# EAGLE design 20A Motor Controller with SLAVE OUT (EAGLE 8.2.1)
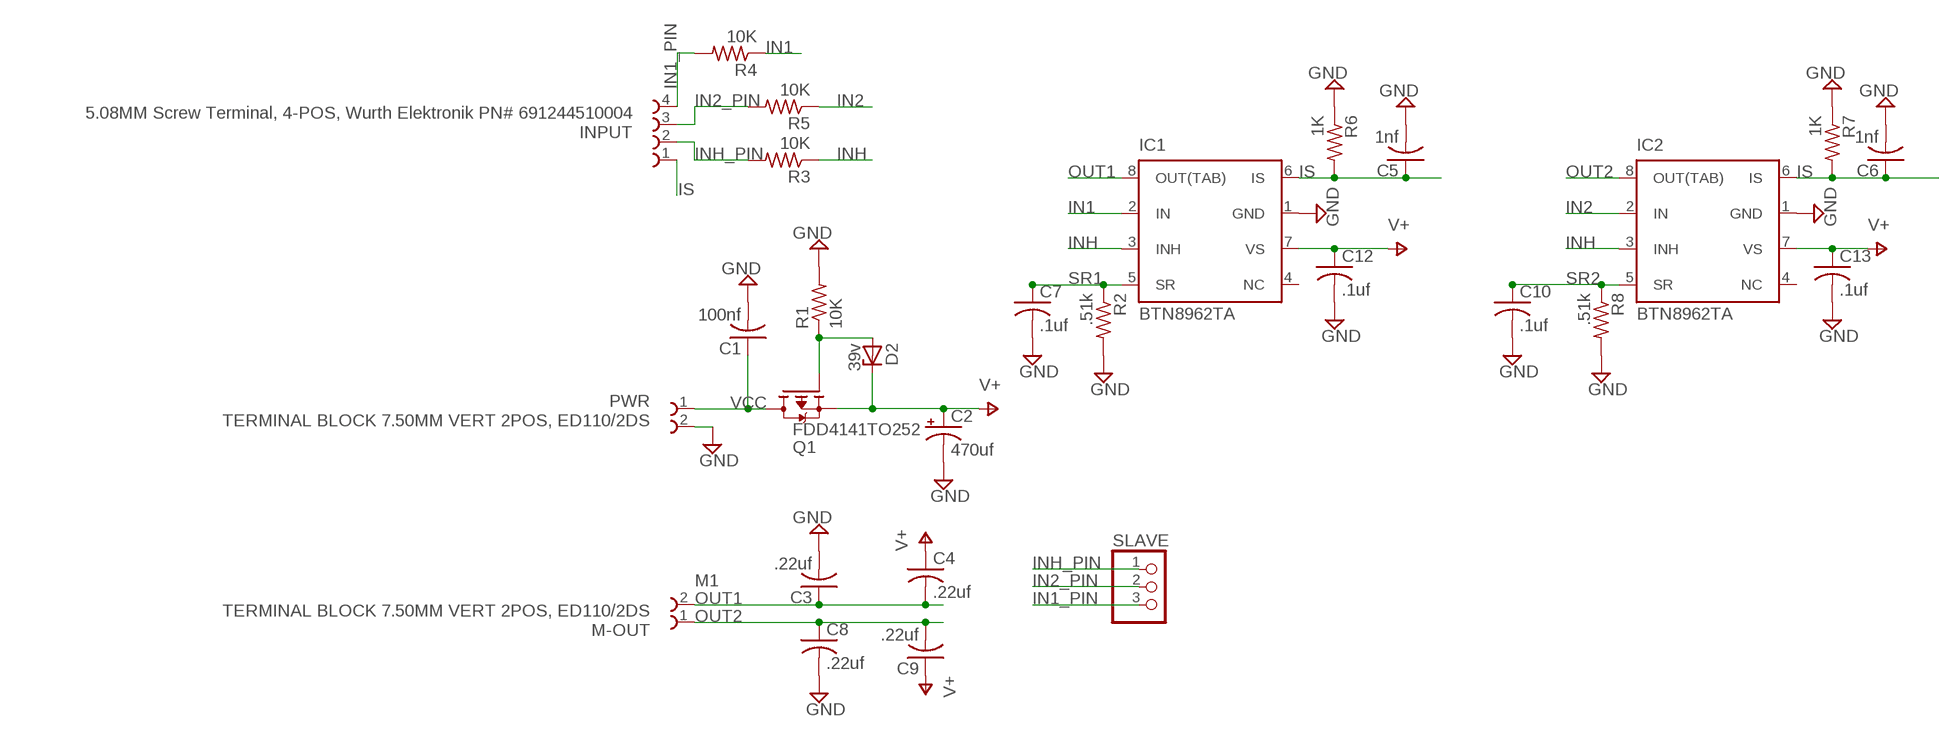
[diagram p0: schematic, sheet 1]

## Parts
C1  100nf  C-USC0805  [C0805]
C2  470uf  CPOL-USTT5D10  [TT5D10]
C3  .22uf  C-USC0805  [C0805]
C4  .22uf  C-USC0805  [C0805]
C5  1nf  C-USC0805  [C0805]
C6  1nf  C-USC0805  [C0805]
C7  .1uf  C-USC0805  [C0805]
C8  .22uf  C-USC0805  [C0805]
C9  .22uf  C-USC0805  [C0805]
C10  .1uf  C-USC0805  [C0805]
C12  .1uf  C-USC0805  [C0805]
C13  .1uf  C-USC0805  [C0805]
D2  39v  ZENER-DIODESMB  [SMB]
IC1  BTN8962TA  [P-TO263-7-1_LG_PADS]
IC2  BTN8962TA  [P-TO263-7-1_LG_PADS]
INPUT  5.08MM Screw Terminal, 4-POS, Wurth Elektronik PN# 691244510004  691244510004  [691244510004]
M-OUT  TERMINAL BLOCK 7.50MM VERT 2POS, ED110/2DS  7-5MM-SCREW-TERM  [7-5MM-SCREW-TERM]
PWR  TERMINAL BLOCK 7.50MM VERT 2POS, ED110/2DS  7-5MM-SCREW-TERM  [7-5MM-SCREW-TERM]
Q1  FDD4141TO252  [TO252]
R1  10K  R-US_R0805  [R0805]
R2  .51k  R-US_R0805  [R0805]
R3  10K  R-US_R0805  [R0805]
R4  10K  R-US_R0805  [R0805]
R5  10K  R-US_R0805  [R0805]
R6  1K  R-US_R0805  [R0805]
R7  1K  R-US_R0805  [R0805]
R8  .51k  R-US_R0805  [R0805]
SLAVE  PINHD-1X3CB  [1X03-CLEANBIG]

## Nets
GND: C1.2 C2.- C3.2 C5.2 C6.2 C7.2 C8.2 C10.2 C12.2 C13.2 IC1.1(GND) IC2.1(GND) PWR.2 R1.2 R2.2 R6.1 R7.1 R8.2
IN1: IC1.2(IN) R4.1
IN1_PIN: INPUT.4 R4.2 SLAVE.3
IN2: IC2.2(IN) R5.1
IN2_PIN: INPUT.3 R5.2 SLAVE.2
INH: IC1.3(INH) IC2.3(INH) R3.1
INH_PIN: INPUT.2 R3.2 SLAVE.1
IS: C5.1 C6.1 IC1.6(IS) IC2.6(IS) INPUT.1 R6.2 R7.2
OUT1 [PWR]: C3.1 C4.2 IC1.8(OUT(TAB)) M-OUT.2
OUT2 [PWR]: C8.1 C9.2 IC2.8(OUT(TAB)) M-OUT.1
Q1_GATE: D2.A Q1.1(G) R1.1
SR1: C7.1 IC1.5(SR) R2.1
SR2: C10.1 IC2.5(SR) R8.1
V+: C2.+ C4.1 C9.1 C12.1 C13.1 D2.C IC1.7(VS) IC2.7(VS) Q1.2(S)
VCC: C1.1 PWR.1 Q1.3(D)
Unconnected: IC1.4(NC) IC2.4(NC)

## Notes on the sheet
- M1

## Library data of the parts
C1 C3-C10 C12 C13 = adafruit:C-US: CAPACITOR, American symbol
C2 = adafruit:CPOL-US: POLARIZED CAPACITOR, American symbol
D2 = diode:ZENER-DIODE: Z-Diode
IC1 IC2 = my-custom-lib:BTN8962TA: 30A Half-H-Bridge for DC-Motor Applications TO-263-7 package Digkey: https://www.digikey.com/product-detail/en/BTN8962TAAUMA1/BTN8962TAAUMA1INCT-ND/4772020 Mouser: http://www.mouser.com/Search/ProductDetail.aspx?R=BTN8962TAAUMA1virtualkey63830000virtualkey726-BTN8962TAAUMA1
INPUT = Wurth_Elektronik_Electromechanic_Terminal_Blocks_Connectors_rev16e:691244510004: SERIE 2445 - 5.08 MM - HORIZONTAL CABLE ENTRY WITH RISING CAGE CLAMP - WR-TBL =>ConTBL2 691244510004 Characteristics INSULATOR:PA6/66 FLAMABILITY RATING: UL94V0 COLOR: GREEN METAL HOUSING: COPPER ALLOY / Ni+Sn TERMINAL SCREW: STEEL / Zn WIRE GUARD: COPPER ALLOY / Ni+Sn OPERATING TEMPERATURE:-30°C UP TO +120°C COMPLIANCE: LEAD FREE AND ROHS ELECTRICAL UL VDE CURRENT RATING: 16A 24A WORKING VOLTAGE: 300VAC 450VAC WITHSTANDING VOLTAGE: 1,6KV 2,5KV <http://katalog.we-online.de/media/images/v2/Family_TBL_5_08_2445_HORIZONTAL_CABLE_ENTRY_W_RISING_CAGE_6912445100xx.jpg> Details see: http://katalog.we-online.de/en/em/TBL_5_08_2445_HORIZONTAL_CABLE_ENTRY_W_RISING_CAGE_6912445100xx 2015 (C) Wurth Elektronik
M-OUT PWR = my-custom-lib:7-5MM-SCREW-TERM: On Shore Technology Inc. ED110/2DS 2-Position, 7.5mm Pitch(0.295"), 14/22AWG, 300V/20A https://www.digikey.com/product-detail/en/on-shore-technology-inc/ED110-2DS/ED1605-ND/33880
Q1 = transistor-fet:FDD4141: P-Channel PowerTrench® MOSFET Source: FDD4141.pdf
R1-R8 = rcl:R-US_: RESISTOR, American symbol
SLAVE = adafruit:PINHD-1X3: PIN HEADER

## Net classes
0 default: width 0.152 mm, drill 0.305 mm, clearance 0.152 mm
1 GND: width 0.152 mm, drill 0.305 mm, clearance 0.152 mm
2 PWR: width 0.305 mm, drill 0.305 mm, clearance 0.203 mm

## Board
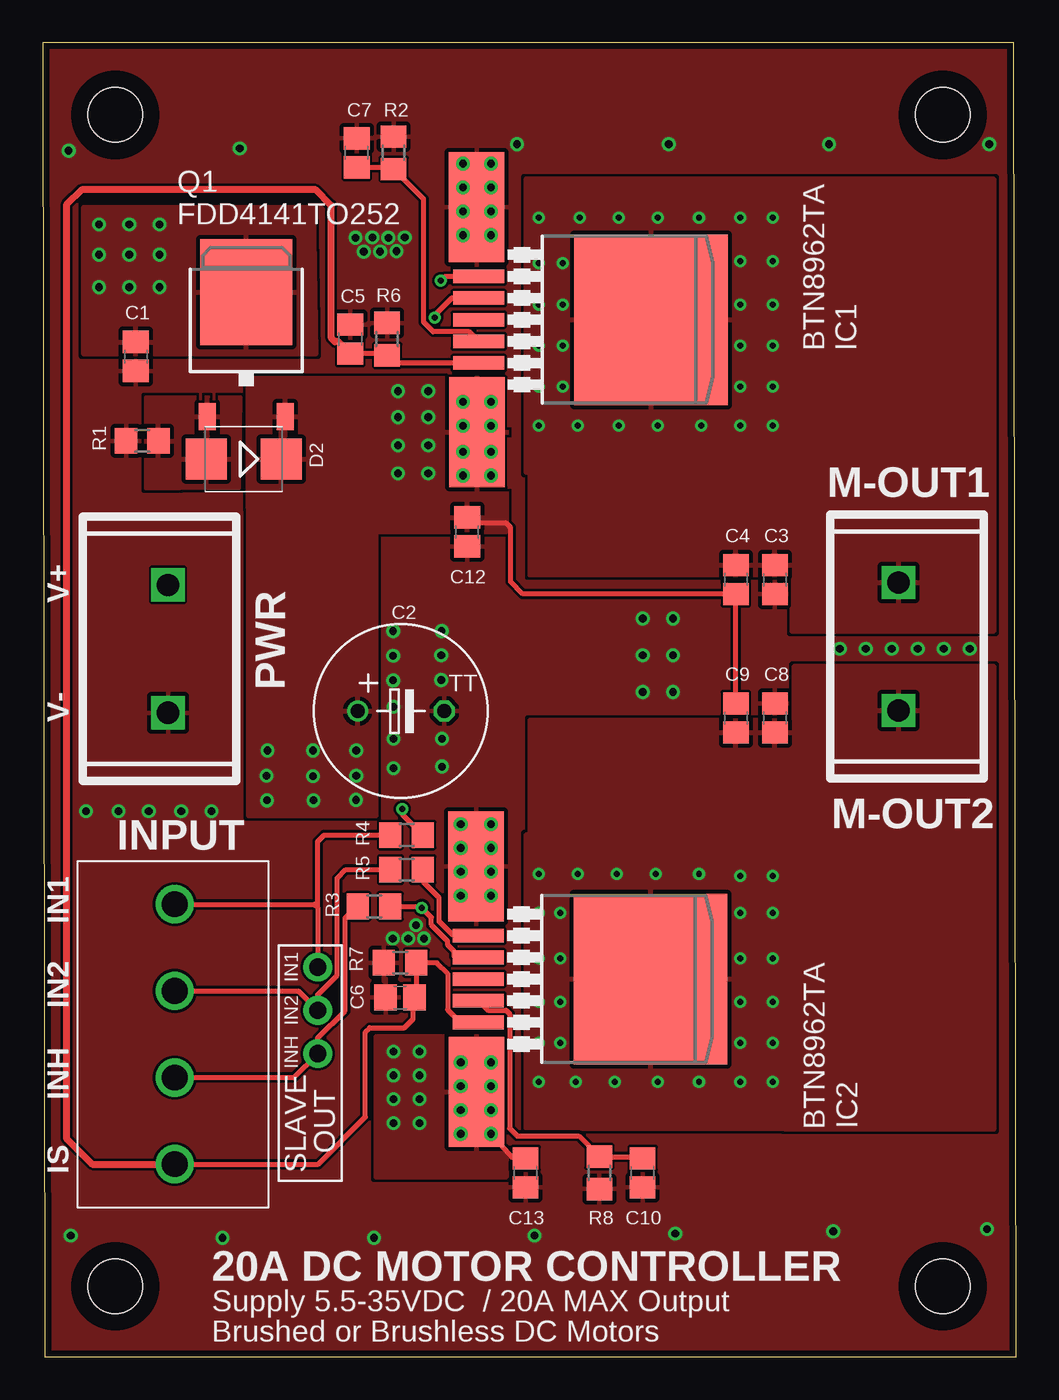
[diagram p1: board, top side]
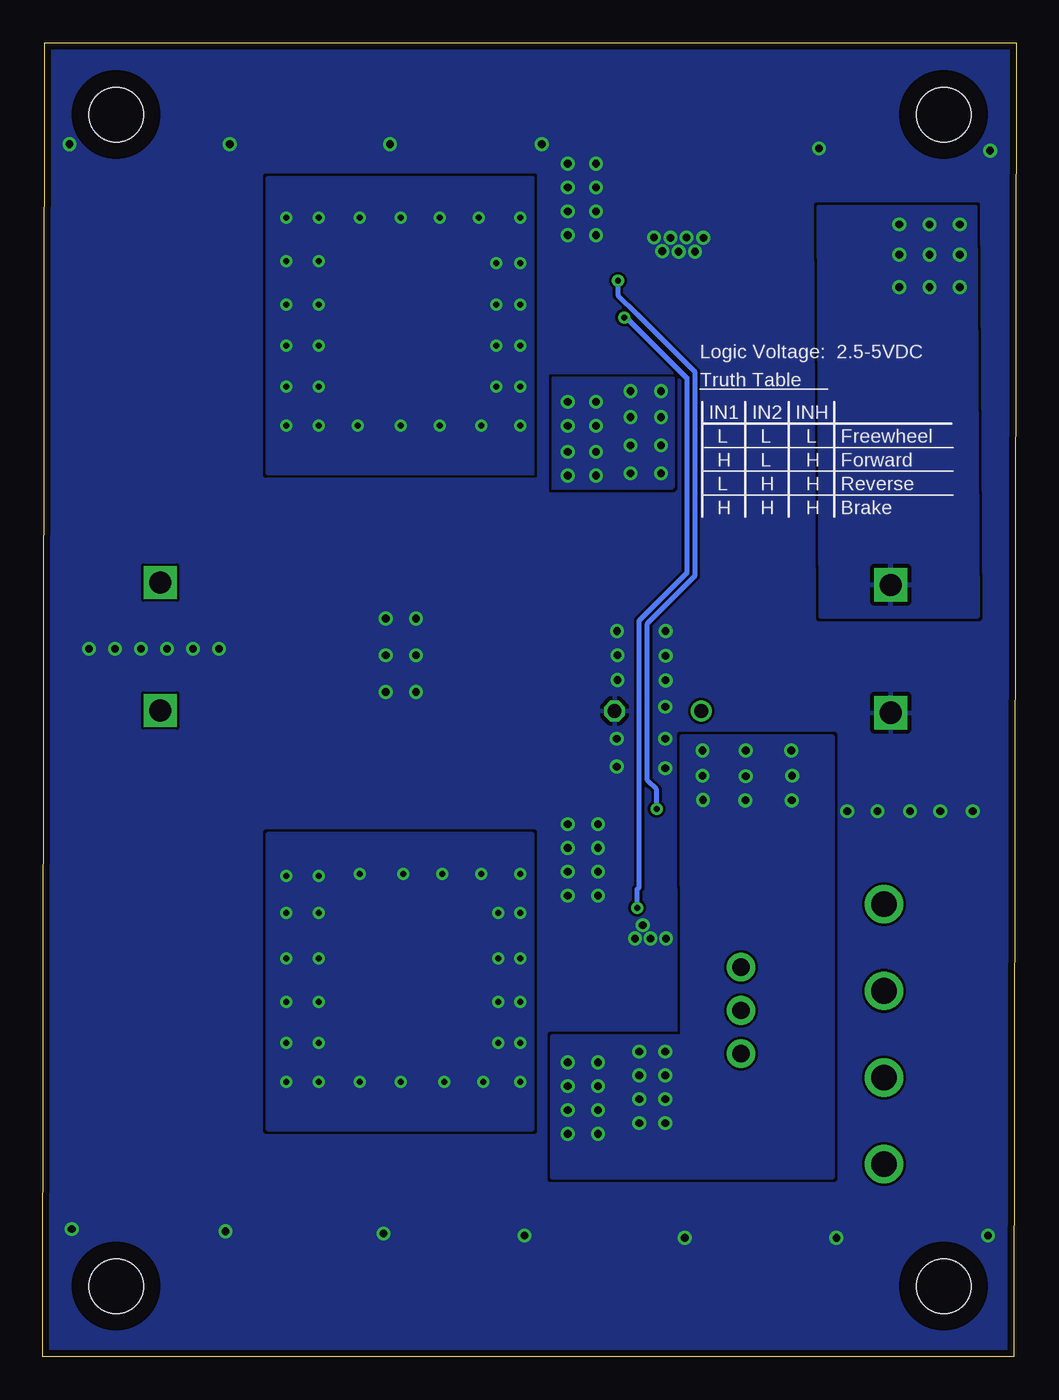
[diagram p2: board, bottom side, seen from below]

Size 57.07 x 77.08 mm. Coordinates in mm from the lower left corner, seen from the top.
Outline: 0.13,0 57.07,0 56.95,77.08 0,77.08 0.13,0
Copper layers (1*16): Top 0.0356mm / dielectric 1.5011mm / Bottom 0.0356mm
Design rules "oshpark-2layer": minimum track width 6mil, minimum drill 13mil, track to track 6mil, track to pad 6mil, pad to pad 6mil, via to via 6mil, smd to smd 6mil, copper to edge 15mil, drill to drill 6mil, minimum pad ring 7mil, minimum via ring 7mil, stop-mask expansion 2.5mil, vias tented up to drill 0mil, thermal gap 10mil
Holes 3.19 mm at 52.77,72.85 4.25,72.85 4.25,4.15 52.77,4.15
tKeepout: area 28.3,13.3 to 43.8,30.7; area 28.3,51.8 to 43.8,69.2
bKeepout: area 28.3,13.3 to 43.8,30.7; area 28.3,51.8 to 43.8,69.2
tRestrict: area 50.8,70.9 to 54.7,74.8; area 2.3,70.9 to 6.2,74.8; area 2.3,2.2 to 6.2,6.1; area 50.8,2.2 to 54.7,6.1
bRestrict: area 50.8,70.9 to 54.7,74.8; area 2.3,70.9 to 6.2,74.8; area 2.3,2.2 to 6.2,6.1; area 50.8,2.2 to 54.7,6.1

### Footprints (pad centres in the part's own frame; a part is rotated, then mirrored left to right if it is on the bottom)
C0805 = smd 1.3 x 1.5: 1 -0.85,0; 2 0.85,0
TT5D10 = drill 0.813: + -2.54,0 | drill 0.813 octagon: - 2.54,0
SMB = smd 2.4 x 2.4: A 2.2,0; C -2.2,0
P-TO263-7-1_LG_PADS = smd 6.452 x 3.251: 1 -6.604,-9.335; 7 6.604,-9.309 | smd 0.8 x 3: 2 -2.54,-9.207; 3 -1.27,-9.207; 4 0,-9.207; 5 1.27,-9.207; 6 2.54,-9.207 | smd 10 x 9: 8 0,0.895
691244510004 = drill 1.5: 1 -7.62,0; 2 -2.54,0; 3 2.54,0; 4 7.62,0
7-5MM-SCREW-TERM = drill 1.3 square: 1 -4,1; 2 3.5,1
TO252 = smd 1 x 1.6: 1 -2.28,-4.8; 2 2.28,-4.8 | smd 5.4 x 6.2: 3 0,2.5
R0805 = smd 1.3 x 1.5: 1 -0.95,0; 2 0.95,0
1X03-CLEANBIG = drill 1.016 pad 1.676: 1 -2.54,0; 2 0,0; 3 2.54,0

### Placement (x,y rotation side)
C1  5.46,58.67 270 top
C2  21.01,37.87 0 top
C3  42.93,45.59 270 top
C4  40.64,45.59 90 top
C5  18.03,59.69 90 top
C6  20.95,21.08 180 top
C7  18.42,70.61 90 top
C8  42.93,37.47 90 top
C9  40.64,37.47 270 top
C10  35.18,10.79 270 top
C12  24.89,48.39 270 top
C13  28.32,10.79 270 top
D2  11.79,52.65 180 top
IC1  34.78,60.83 270 top
IC2  34.75,22.16 270 top
INPUT  7.75,18.92 90 top
M-OUT  51.18,41.91 90 top
PWR  6.35,41.27 270 top
Q1  11.94,59.94 0 top
R1  5.84,53.72 180 top
R2  20.57,70.61 90 top
R3  19.43,26.42 180 top
R4  21.34,30.61 180 top
R5  21.34,28.58 180 top
R6  20.19,59.69 270 top
R7  20.95,23.11 0 top
R8  32.64,10.79 270 top
SLAVE  16.13,20.32 90 top

### Tracks (layer width: path | path; a pad name or v marks a point on that pad's centre or on a via)
GND  (via drill 0.45)
  other vias: 24.64,69.98 26.29,69.98 24.64,68.58 24.64,67.18 24.64,65.79 26.29,65.79 26.29,68.58 26.29,67.18 46.74,41.53 48.26,41.53 49.78,41.53 51.31,41.53 52.83,41.53 54.36,41.53 24.51,27.05 26.29,27.05 26.29,28.45 26.29,29.85 36.96,43.31 24.51,31.24 24.51,29.85 24.51,28.45 36.96,41.15 36.96,38.99 26.29,31.24 20.55,41.12 20.57,38.13 20.57,34.52 2.54,32 4.45,32 8.13,32 1.65,7.11 10.54,6.98 19.43,6.98 28.83,7.11 37.08,7.24 46.36,7.37 55.37,7.49 1.52,70.74 11.56,70.87 27.81,71.12 36.7,71.12 46.1,71.12 55.5,71.12 20.55,39.67 20.57,36.25 6.22,32 9.91,32 35.18,43.31 35.18,41.15 35.18,38.99 23.42,34.62 23.42,36.25 23.37,39.7 23.37,41.15 20.55,42.57 23.39,42.57 21.44,24.54 22.35,24.54 20.52,24.54 21.89,25.32 18.34,65.63 19.33,65.66 20.27,65.63 21.23,65.66 18.82,64.82 19.79,64.82 20.75,64.85
  pour Top (rank 6): 0,77.09 0.13,0 56.9,0 56.9,77.09
  pour Bottom (rank 6): 0,77.09 0.13,0 56.9,0 56.9,77.09
IN1  (via drill 0.35)
  Top 0.305: IC1.2 23.59,63.37 v23.34,63.12 | v21.08,32.13 21.08,31.82 R4.1
  Bottom 0.305: v23.34,63.12 23.34,62.28 22.23,61.16 18.85,57.79 18.85,45.79 21.62,43.02 21.62,33.81 21.08,33.27 v21.08,32.13
IN1_PIN
  Top 0.305: 16.13,26.35 SLAVE.3 | 16.13,26.35 16.13,30.23 16.51,30.61 R4.2 | 16.13,26.35 15.94,26.54 INPUT.4
IN2
  Top 0.305: IC2.2 24,24.77 23.24,25.53 23.24,26.92 22.35,27.81 R5.1
IN2_PIN
  Top 0.305: R5.2 17.78,28.58 17.27,28.07 17.27,22.39 16.13,21.24 SLAVE.2 14.99,21.46 INPUT.3
INH  (via drill 0.35)
  Top 0.305: IC2.3 25.48,23.5 24.13,23.5 24.13,23.78 23.74,24.17 23.74,24.38 23.67,24.45 23.05,25.07 22.78,25.34 22.78,25.78 v22.23,26.34 21.97,26.42 R3.1 | IC1.3 24,62.1 22.99,61.09 v22.99,60.96
  Bottom 0.305: v22.99,60.96 22.73,60.83 19.3,57.4 19.3,45.97 22.1,43.18 22.1,27.51 22.23,27.43 v22.23,26.34
INH_PIN
  Top 0.305: R3.2 18.16,26.16 17.73,25.73 17.73,20.3 16.13,18.7 SLAVE.1 14.73,16.38 INPUT.2
IS
  Top 0.305: IC1.6 20.65,58.29 R6.2 20.09,58.84 C5.1 | IC2.6 24.48,19.62 23.74,20.36 23.74,22.49 23.11,23.11 R7.2 21.91,21.18 C6.1 21.72,20.99 21.72,19.81 21.21,19.3 19.18,19.3 18.92,19.05 18.92,14.07 16.15,11.3 INPUT.1
  Top 0.406: C5.1 17.34,59.53 17.14,59.53 16.93,59.74 16.93,67.53 16,68.45 2.29,68.45 1.4,67.56 1.4,12.83 2.92,11.3 INPUT.1 | 25.48,19.69 IC2.6
OUT1  (via drill 0.35)
  other vias: 29.08,66.8 29.08,64.13 29.08,61.72 29.08,59.31 29.08,56.9 29.08,54.61 33.78,66.8 36.07,66.8 38.48,66.8 40.89,66.8 40.89,64.26 40.89,61.72 40.89,59.31 40.89,56.9 40.89,54.61 33.78,54.61 36.07,54.61 38.61,54.61 42.8,66.8 42.8,64.26 42.8,61.72 42.8,59.31 42.8,56.9 42.8,54.61 31.5,66.8 30.48,64.13 30.48,61.72 30.48,59.31 30.48,56.9 31.37,54.61
  pour Bottom: 43.87,69.11 43.87,51.86 28.36,51.86 28.36,69.11
  pour Top: 43.87,69.11 43.87,51.86 28.36,51.86 28.36,69.11
  pour Top: 55.75,42.55 43.94,42.55 43.94,45.72 44.07,45.85 28.58,45.85 28.58,52.07 43.56,52.07 43.56,69.09 55.75,69.09
OUT2  (via drill 0.35)
  other vias: 29.08,28.32 29.08,26.04 29.08,18.42 29.08,23.37 29.08,20.83 40.89,26.04 33.66,28.32 35.94,28.32 38.48,28.32 40.89,28.19 42.8,28.19 29.08,16.13 33.53,16.13 36.07,16.13 38.48,16.13 40.89,16.13 42.8,20.83 42.8,23.37 42.8,26.04 42.8,18.42 42.8,16.13 40.89,23.37 40.89,20.83 40.89,18.42 31.37,28.32 30.35,26.04 30.35,23.37 30.35,20.83 30.35,18.42 31.24,16.13
  pour Bottom: 43.87,30.63 43.87,13.38 28.36,13.38 28.36,30.63
  pour Top: 43.87,30.63 43.87,13.38 28.36,13.38 28.36,30.63
  pour Top: 55.75,40.51 55.75,13.33 43.56,13.33 43.56,30.35 28.58,30.35 28.58,37.34 44.07,37.34 44.07,40.51
Q1_GATE
  pour Top: 6.1,50.95 6.1,56.26 11.56,56.26 11.48,50.98 8,50.95
SR1
  Top 0.305: C7.1 20.47,69.76 | IC1.5 25.01,60.12 22.89,60.12 22.33,60.69 22.33,67.91 R2.1
  Top 0.406: R2.1 20.47,69.76
SR2
  Top 0.305: IC2.5 26.11,20.32 27.17,20.32 27.37,20.12 27.37,13.39 27.81,12.95 31.43,12.95 R8.1 34.57,11.74 C10.1
V+  (via drill 0.45)
  Top 0.305: C12.1 25.62,48.9 27.18,48.9 27.43,48.64 27.43,45.47 28.16,44.74 C4.1 C9.1 | IC2.7 25.44,13.29 | C13.1 27.6,11.64 v26.29,13.08
  other vias: 20.83,56.64 22.61,56.64 20.83,55.12 20.83,53.47 20.83,51.82 22.61,51.82 22.61,53.47 22.61,55.12 24.64,56.01 26.29,56.01 26.29,54.61 26.29,53.09 26.29,51.69 24.64,51.69 24.64,53.09 24.64,54.61 24.51,17.27 26.29,17.27 26.29,15.87 24.51,15.87 24.51,14.48 24.51,13.08 26.29,14.48 20.57,17.91 22.1,16.51 22.1,15.11 20.57,16.51 20.57,15.11 20.57,13.72 22.1,13.72 22.1,17.91 13.18,35.56 15.85,35.56 18.39,35.56 13.13,34.09 15.85,34.06 18.39,34.09 18.36,32.66 15.88,32.64 13.16,32.64
  pour Top: 12.07,57.4 27.18,57.4 27.18,48.39 19.05,48.39 19.05,49.78 12.07,49.78
  pour Bottom: 20.07,57.4 20.07,51.05 20.19,50.93 27.18,50.93 27.18,57.4
  pour Top: 27.18,18.8 27.18,10.54 19.56,10.54 19.56,18.8
  pour Bottom: 27.18,10.54 27.18,18.8 19.56,18.8 19.58,36.37 10.8,36.37 10.8,10.54
  pour Top: 19.56,31.75 19.56,50.29 12.07,50.29 12.07,31.75
VCC  (via drill 0.45)
  other vias: 3.3,66.42 5.08,66.42 6.86,66.42 6.86,64.64 6.86,62.74 5.08,64.64 5.08,62.74 3.3,62.74 3.3,64.64
  pour Bottom: 2.29,43.43 11.43,43.43 11.56,67.44 2.41,67.44
  pour Top: 2.41,67.44 15.88,67.44 16,58.8 2.41,58.8

### Text on the board
tPlace: M-OUT1 | V+ | V- | PWR | M-OUT2 | IN1 | IN2 | IN1 | IN2 | INH | INH | IS | OUT | 20A DC MOTOR CONTROLLER | Supply 5.5-35VDC / 20A MAX Output | Brushed or Brushless DC Motors
bPlace: Logic Voltage: 2.5-5VDC | Truth Table | INH | IN2 | IN1 | Freewheel | L | L | L | Forward | H | L | H | Reverse | H | H | L | Brake | H | H | H
Reference: rev 1.0